# EasyEDA schematic SCH_LucidVR_Proto5_SensorModule_RevB.json
TITLE: LucidVRSensorProto5.2; REV: 1.0; Date: 2023-02-06; Sheet: 1/1; Company: moonwiz
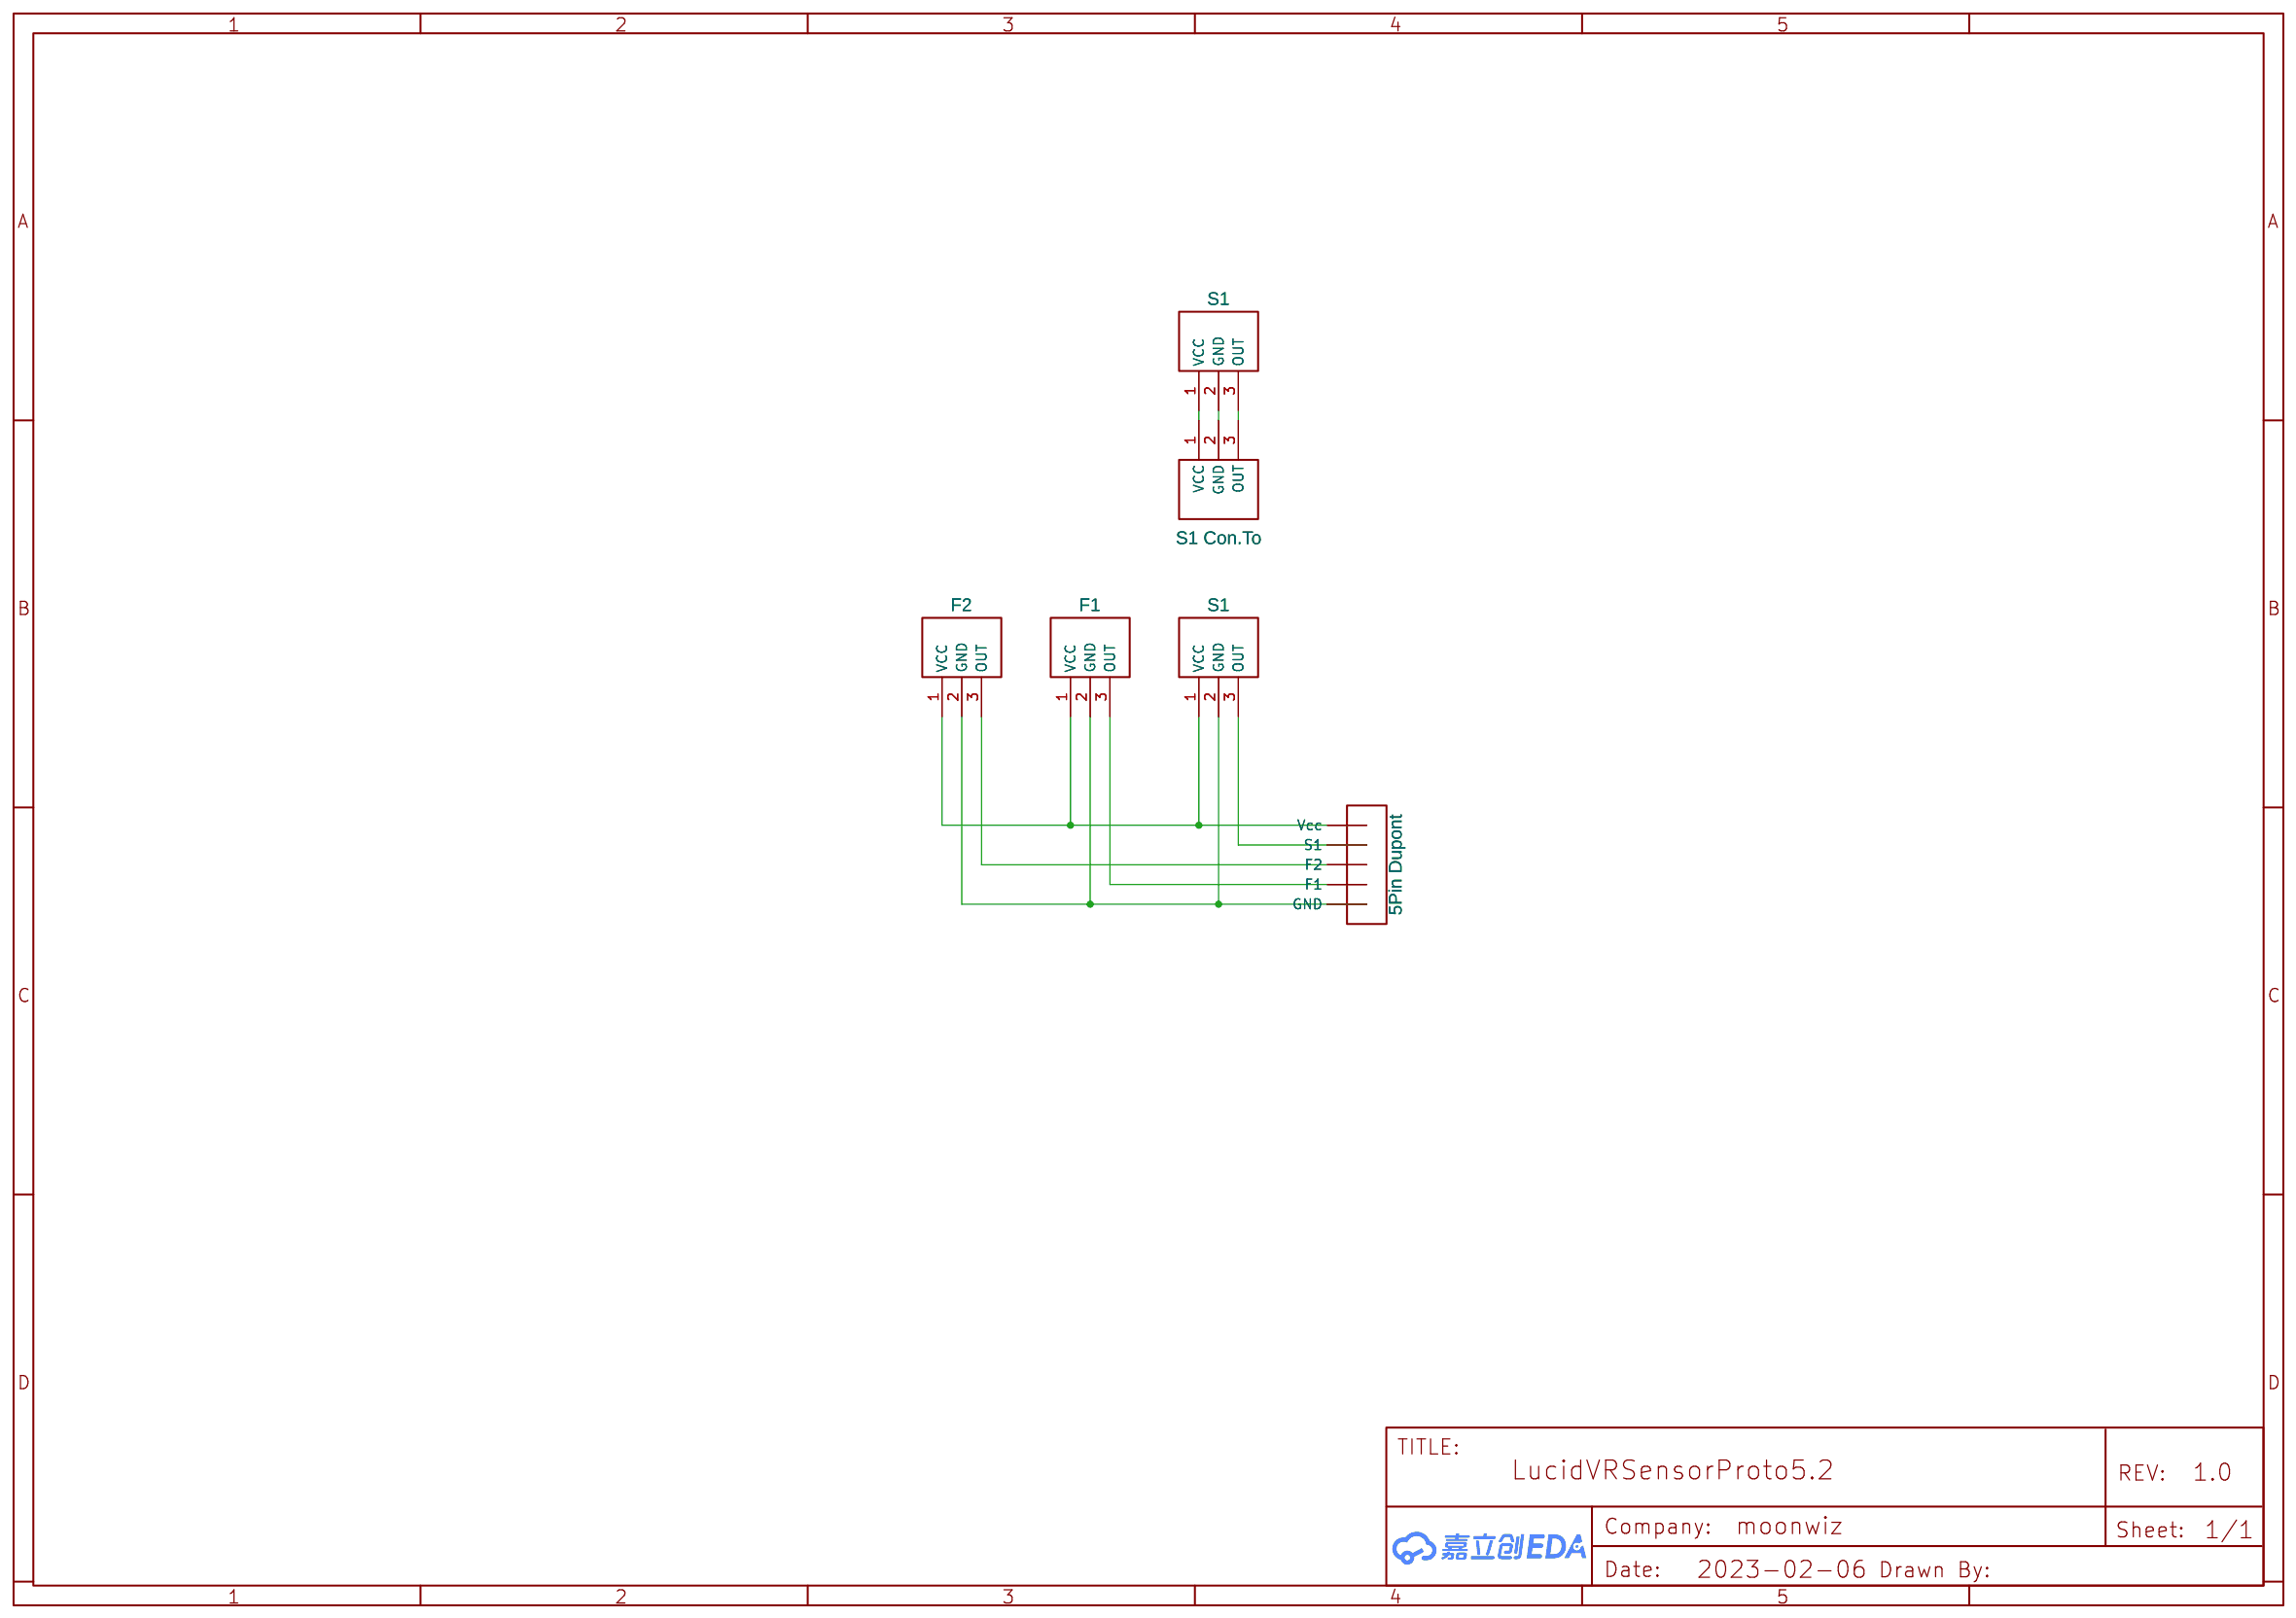
[diagram p0: schematic sheet]

## Parts
S1  S1 Con.To  [SIP-3_L4.1-W1.5-P1.3-L]
S2  S1  [SIP-3_L4.1-W1.5-P1.3-L]
S4  F1  [SIP-3_L4.1-W1.5-P1.3-L]
S5  S1  [SIP-3_L4.1-W1.5-P1.3-L]
S6  F2  [SIP-3_L4.1-W1.5-P1.3-L]
U3  5Pin Dupont  [5PIN DUPONT]

## Library data of the parts
S1 S2 S4-S6 = OH49E: Supplier: LCSC; Manufacturer: 南京欧卓; Supplier Part: C81386; JLCPCB Part Class: Extended Part
U3 = 5Pin Dupont: Contributor: joeduderey

## Nets
Net-(S1-1): S1.1(VCC) S5.1(VCC)
Net-(S1-2): S1.2(GND) S5.2(GND)
Net-(S1-3): S1.3(OUT) S5.3(OUT)
Net-(S2-1): S2.1(VCC) S4.1(VCC) S6.1(VCC) U3.1(Vcc)
Net-(S2-2): S2.2(GND) S4.2(GND) S6.2(GND) U3.5(GND)
Net-(S2-3): S2.3(OUT) U3.2(S1)
Net-(S4-3): S4.3(OUT) U3.4(F1)
Net-(S6-3): S6.3(OUT) U3.3(F2)
